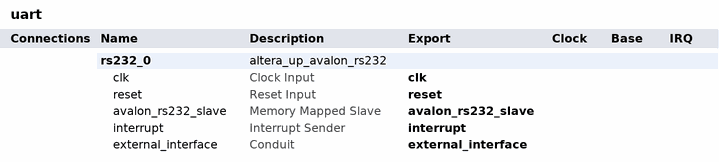
[diagram p0: system contents]
# Platform Designer (Qsys) system uart, Cyclone IV E EP4CE115F29C7
# Parameters at their usual value, and those the tool derives, are not listed.
package require -exact qsys 17.1
create_system uart
set_project_property DEVICE_FAMILY {Cyclone IV E}
set_project_property DEVICE EP4CE115F29C7

add_instance rs232_0 altera_up_avalon_rs232 17.1
set_instance_property rs232_0 AUTO_EXPORT true
set_instance_parameter_value rs232_0 baud 9600
set_instance_parameter_value rs232_0 parity None

# exported interfaces
add_interface avalon_rs232_slave avalon slave
set_interface_property avalon_rs232_slave EXPORT_OF rs232_0.avalon_rs232_slave
add_interface clk clock sink
set_interface_property clk EXPORT_OF rs232_0.clk
add_interface external_interface conduit end
set_interface_property external_interface EXPORT_OF rs232_0.external_interface
add_interface interrupt interrupt sender
set_interface_property interrupt EXPORT_OF rs232_0.interrupt
add_interface reset reset sink
set_interface_property reset EXPORT_OF rs232_0.reset

set_interconnect_requirement {$system} qsys_mm.clockCrossingAdapter HANDSHAKE
set_interconnect_requirement {$system} qsys_mm.enableEccProtection FALSE
set_interconnect_requirement {$system} qsys_mm.insertDefaultSlave FALSE
set_interconnect_requirement {$system} qsys_mm.maxAdditionalLatency 1

save_system uart.qsys
